# EasyEDA Pro project EasyEDA BMI Pinout.epro

# Board BMI Pinout
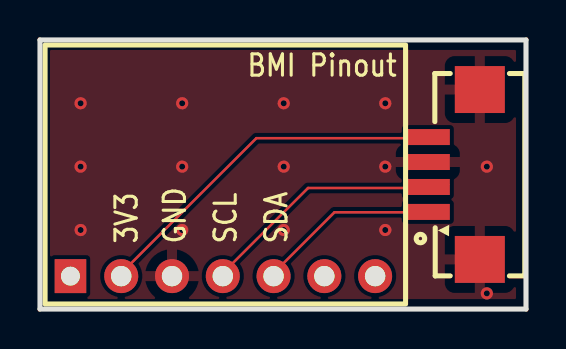
[diagram p0: board, top side]
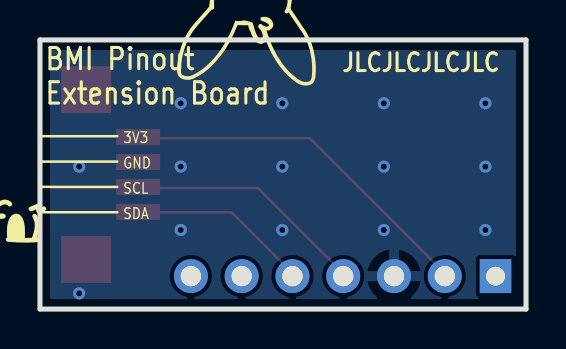
[diagram p1: board, bottom side, seen from below]

Outline 24.31 x 13.49 mm; copper layers: Top Layer, Bottom Layer. Coordinates in mm from the lower left corner of the outline.
Outline path: 0,13.49 24.31,13.49 24.31,0 0,0 0,13.49
Stack: Top Layer 0.035mm / Dielectric1 0.91mm FR4 er 4.5 / Bottom Layer 0.035mm

## Design rules (mm)
spacing Default (default): track to track 0.127, other pairs 0 to 0.127
track width Default (default): min 0.127, default 0.127, max 25.4
differential pair differentialPair (default): width min 0.127, default 0.254, max 2.54; gap min 0.152, default 0.152
via Default (default): diameter min 0.61, default 0.61, max 100.025; hole min 0.305, default 0.305, max 59.995
net GND uses gge20888(1)

## Placement (name value [footprint] x y rotation side)
CN1  HC-1.25-4PWT  [CONN-SMD_4P-P1.25-HC-1.25-4PWT]  20.7 6.74 90 top
CONN1  -  [hdr-th_10p-p2.54-v-m-1]  12.95 1.65 0 top

## Footprints (pads in the part's own frame, mm; a bottom-side part is the same pattern mirrored in y, then rotated)
CONN-SMD_4P-P1.25-HC-1.25-4PWT
  rect 0.8x2.2 smd: 1(-1.875,1.3) 2(-0.625,1.3) 3(0.625,1.3) 4(1.875,1.3)
  rect 2.35x2.5 smd: 5(4.255,-1.3) 6(-4.255,-1.3)
hdr-th_10p-p2.54-v-m-1
  rect 1.575x1.7 hole 0.945: 1(-11.43,0)
  round 1.7 hole 1.02: 2(-8.89,0) 3(-6.35,0) 4(-3.81,0) 5(-1.27,0) 6(1.27,0) 7(3.81,0)

## Nets
3V3: CN1.4 CONN1.2
GND: CN1.3 CN1.5 CN1.6 CONN1.3
SCL: CN1.2 CONN1.4
SDA: CN1.1 CONN1.5

Pads without a net: CONN1 1 6 7

## Via types
v1: diameter 0.61, hole 0.305, Top Layer to Bottom Layer, 14 vias

## Routing (per net, layer and track width the routed paths; a pad name or vN(x,y) marks a point on that pad's centre or on a via; arc(x,y) is an arc through that point)
3V3: length 19
  Top Layer w0.127: 4.06,1.8 10.82,8.56 20.24,8.56
GND:
  vias: v1(2.03,10.31) v1(2.03,7.14) v1(2.03,3.96) v1(7.11,10.31) v1(7.11,7.14) v1(7.11,3.96) v1(12.19,10.31) v1(12.19,7.14) v1(12.19,3.96) v1(17.27,10.31) v1(17.27,7.14) v1(17.27,3.96) v1(22.35,7.14) v1(22.35,0.79)
SCL: length 13.1
  Top Layer w0.127: 9.14,1.8 13.41,6.07 20.24,6.07 20.42,6.24
SDA: length 10
  Top Layer w0.127: 20.4,4.97 20.28,4.85 14.73,4.85 11.68,1.8

## Copper pours and planes (outline as drawn; the poured copper is in the pictures)
GND on Top Layer: -2.67,14.88 24.64,14.88 24.64,-1.75 -2.67,-1.75
GND on Bottom Layer: -3.05,14.88 25.53,14.88 25.53,-2.39 -3.05,-2.39

## Text on the board
Bottom Silkscreen Layer: 3V3 | GND | SCL | SDA | JLCJLCJLCJLC | BMI Pinout / Extension Board | BMI Pinout / Extension / Board
Top Silkscreen Layer: BMI Pinout | 3V3 | GND | SCL | SDA
